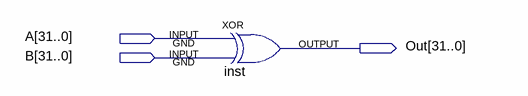
[diagram p0: schematic sheet]
// Quartus schematic Xor32x.bdf as structural Verilog: 1 symbols, 3 pins
module Xor32x (
  input  [31:0] A,
  input  [31:0] B,
  output [31:0] Out
);

  assign Out = A ^ B;  // XOR inst, 32 bits wide
endmodule
